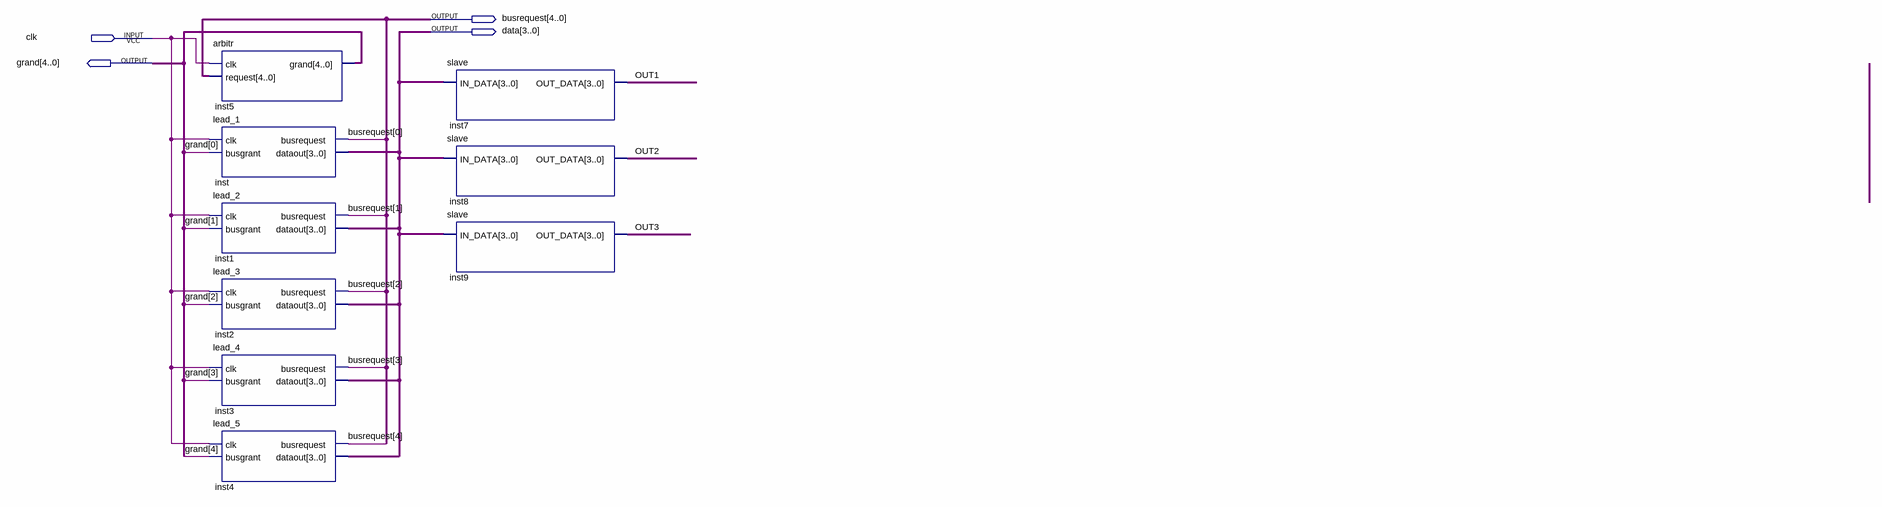
[diagram p0: schematic sheet]
// Quartus schematic main.bdf as structural Verilog: 9 symbols, 4 pins
module main (
  input  clk,
  output [4:0] busrequest,
  output [3:0] data,
  output [4:0] grand
);

  wire OUT1, OUT2, OUT3;

  arbitr inst5 (.clk(clk), .request(busrequest), .grand(grand));
  lead_1 inst (.clk(clk), .busgrant(grand[0]), .busrequest(busrequest[0]), .dataout(data));
  lead_2 inst1 (.clk(clk), .busgrant(grand[1]), .busrequest(busrequest[1]), .dataout(data));
  lead_3 inst2 (.clk(clk), .busgrant(grand[2]), .busrequest(busrequest[2]), .dataout(data));
  lead_4 inst3 (.clk(clk), .busgrant(grand[3]), .busrequest(busrequest[3]), .dataout(data));
  lead_5 inst4 (.clk(clk), .busgrant(grand[4]), .busrequest(busrequest[4]), .dataout(data));
  slave inst7 (.IN_DATA(data), .OUT_DATA(OUT1));
  slave inst8 (.IN_DATA(data), .OUT_DATA(OUT2));
  slave inst9 (.IN_DATA(data), .OUT_DATA(OUT3));
endmodule
